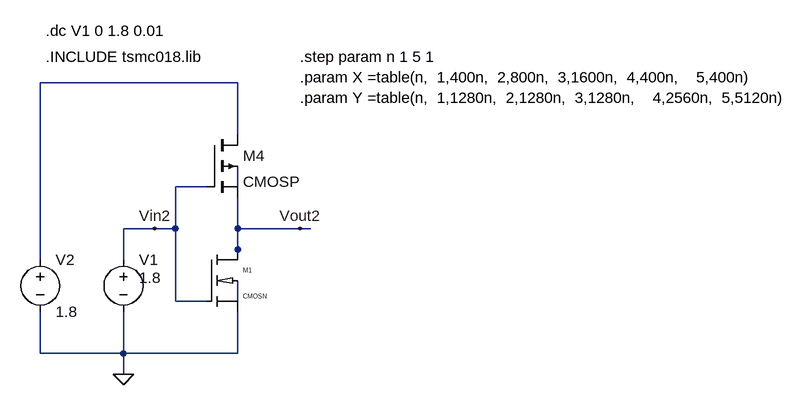
[diagram p0: schematic VTC_CMOS2_1C.asc]
VTC_CMOS2_1C.asc, the LTspice schematic file:
Version 4
SHEET 1 2184 1940
WIRE -528 -64 -832 -64
WIRE -528 16 -528 -64
WIRE -576 96 -624 96
WIRE -528 96 -528 64
WIRE -656 160 -704 160
WIRE -624 160 -624 96
WIRE -624 160 -656 160
WIRE -528 160 -528 112
WIRE -432 160 -528 160
WIRE -416 160 -432 160
WIRE -528 192 -528 160
WIRE -832 208 -832 -64
WIRE -704 208 -704 160
WIRE -528 208 -528 192
WIRE -624 272 -624 160
WIRE -576 272 -624 272
WIRE -528 272 -528 240
WIRE -832 352 -832 288
WIRE -704 352 -704 288
WIRE -704 352 -832 352
WIRE -528 352 -528 288
WIRE -528 352 -704 352
WIRE -704 384 -704 352
FLAG -704 384 0
FLAG -656 160 Vin2
FLAG -432 160 Vout2
DATAFLAG -624 96 ""
SYMBOL voltage -704 192 R0
WINDOW 123 0 0 Left 0
WINDOW 39 0 0 Left 0
WINDOW 3 24 44 Left 2
SYMATTR Value 1.8
SYMATTR InstName V1
SYMBOL voltage -832 192 R0
WINDOW 123 0 0 Left 0
WINDOW 39 0 0 Left 0
SYMATTR InstName V2
SYMATTR Value 1.8
SYMBOL cmosn -576 192 R0
SYMATTR InstName M1
SYMATTR Value2 l=180n w=X
SYMBOL cmosp -576 16 R0
SYMATTR InstName M4
SYMATTR Value2 l=180n w=Y
TEXT -824 -104 Left 2 !.INCLUDE tsmc018.lib
TEXT -824 -144 Left 2 !.dc V1 0 1.8 0.01
TEXT -432 -104 Left 2 !.step param n 1 5 1\n.param X =table(n,  1,400n,  2,800n,  3,1600n,  4,400n,    5,400n)\n.param Y =table(n,  1,1280n,  2,1280n,  3,1280n,    4,2560n,  5,5120n)

The netlist it stands for:
* VTC_CMOS2_1C.asc
V1 Vin2 0 1.8
V2 N001 0 1.8
M1 Vout2 Vin2 0 N003 CMOSN l=180n w=X
M4 N001 Vin2 Vout2 N002 CMOSP l=180n w=Y
.model NMOS NMOS
.model PMOS PMOS
.lib standard.mos
.INCLUDE tsmc018.lib
.dc V1 0 1.8 0.01
.step param n 1 5 1
.param X =table(n,  1,400n,  2,800n,  3,1600n,  4,400n,    5,400n)
.param Y =table(n,  1,1280n,  2,1280n,  3,1280n,    4,2560n,  5,5120n)
.lib tsmc018.lib
.backanno
.end

* Results of the author's LTspice run, read from the files saved beside the schematic
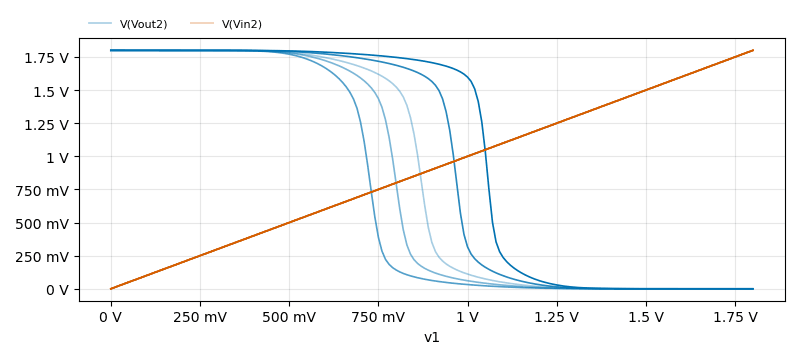
[diagram p1: DC transfer characteristic of VTC_CMOS2_1C.asc, plotted from the saved traces]
* DC transfer characteristic, 5 runs:
*   V(Vout2) [n=1]: 1.8 V at v1=0 V, 28.71 nV at v1=1.8 V, min 28.71 nV, max 1.8 V
*   V(Vout2) [n=2]: 1.8 V at v1=0 V, 16.43 nV at v1=1.8 V, min 16.43 nV, max 1.8 V
*   V(Vout2) [n=3]: 1.8 V at v1=0 V, 8.858 nV at v1=1.8 V, min 8.858 nV, max 1.8 V
*   V(Vout2) [n=4]: 1.8 V at v1=0 V, 46.19 nV at v1=1.8 V, min 46.19 nV, max 1.8 V
*   V(Vout2) [n=5]: 1.8 V at v1=0 V, 82.73 nV at v1=1.8 V, min 82.73 nV, max 1.8 V
*   V(Vin2) [n=1]: 0 V at v1=0 V, 1.8 V at v1=1.8 V, min 0 V, max 1.8 V
*   V(Vin2) [n=2]: 0 V at v1=0 V, 1.8 V at v1=1.8 V, min 0 V, max 1.8 V
*   V(Vin2) [n=3]: 0 V at v1=0 V, 1.8 V at v1=1.8 V, min 0 V, max 1.8 V
*   V(Vin2) [n=4]: 0 V at v1=0 V, 1.8 V at v1=1.8 V, min 0 V, max 1.8 V
*   V(Vin2) [n=5]: 0 V at v1=0 V, 1.8 V at v1=1.8 V, min 0 V, max 1.8 V